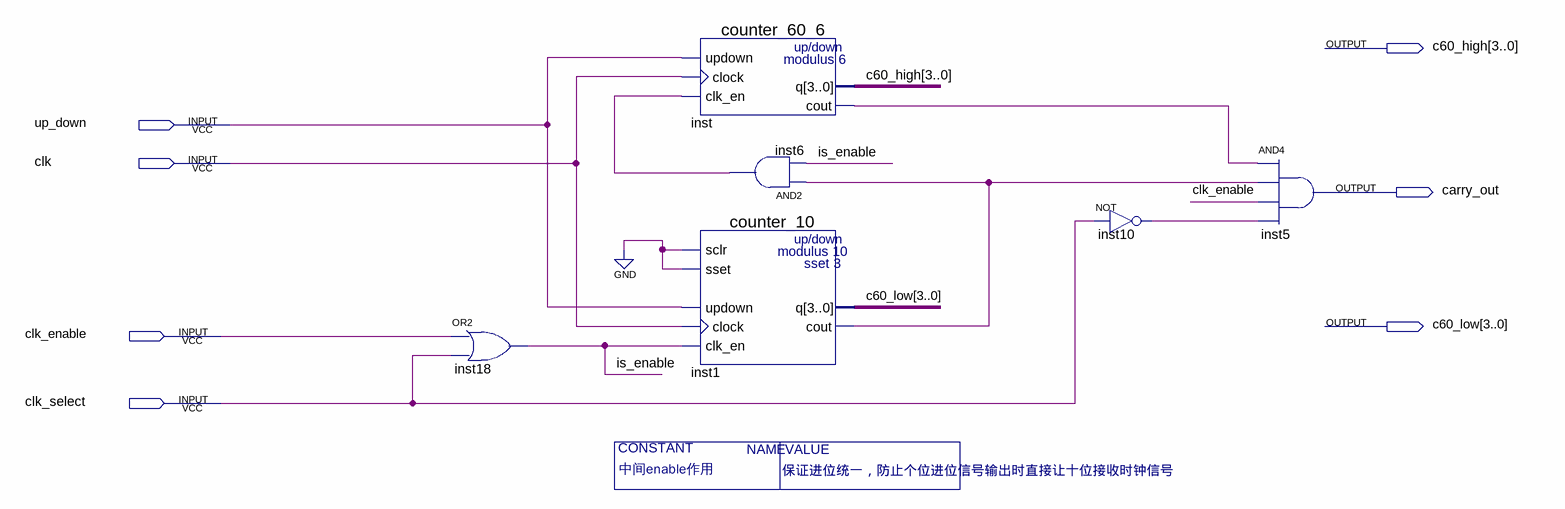
[diagram p0: schematic sheet]
// Quartus schematic counter_60.bdf as structural Verilog: 6 symbols, 7 pins
module counter_60 #(parameter \中间enable作用  = "保证进位统一，防止个位进位信号输出时直接让十位接收时钟信号") (
  input  up_down,
  input  clk,
  input  clk_enable,
  input  clk_select,
  output [3:0] c60_high,
  output carry_out,
  output [3:0] c60_low
);

  wire inst1_cout, inst6_out, inst10_out, inst_cout, is_enable;

  or inst18 (is_enable, clk_enable, clk_select);
  counter_60_6 inst (.updown(up_down), .clock(clk), .clk_en(inst6_out), .q(c60_high), .cout(inst_cout));
  and inst6 (inst6_out, inst1_cout, is_enable);
  counter_10 inst1 (
    .sclr(1'b0), .sset(1'b0), .updown(up_down), .clock(clk), .clk_en(is_enable), .q(c60_low),
    .cout(inst1_cout));
  not inst10 (inst10_out, clk_select);
  and inst5 (carry_out, inst_cout, inst1_cout, clk_enable, inst10_out);
endmodule
